# EAGLE design DigiPCJoy (EAGLE 7.2.0)
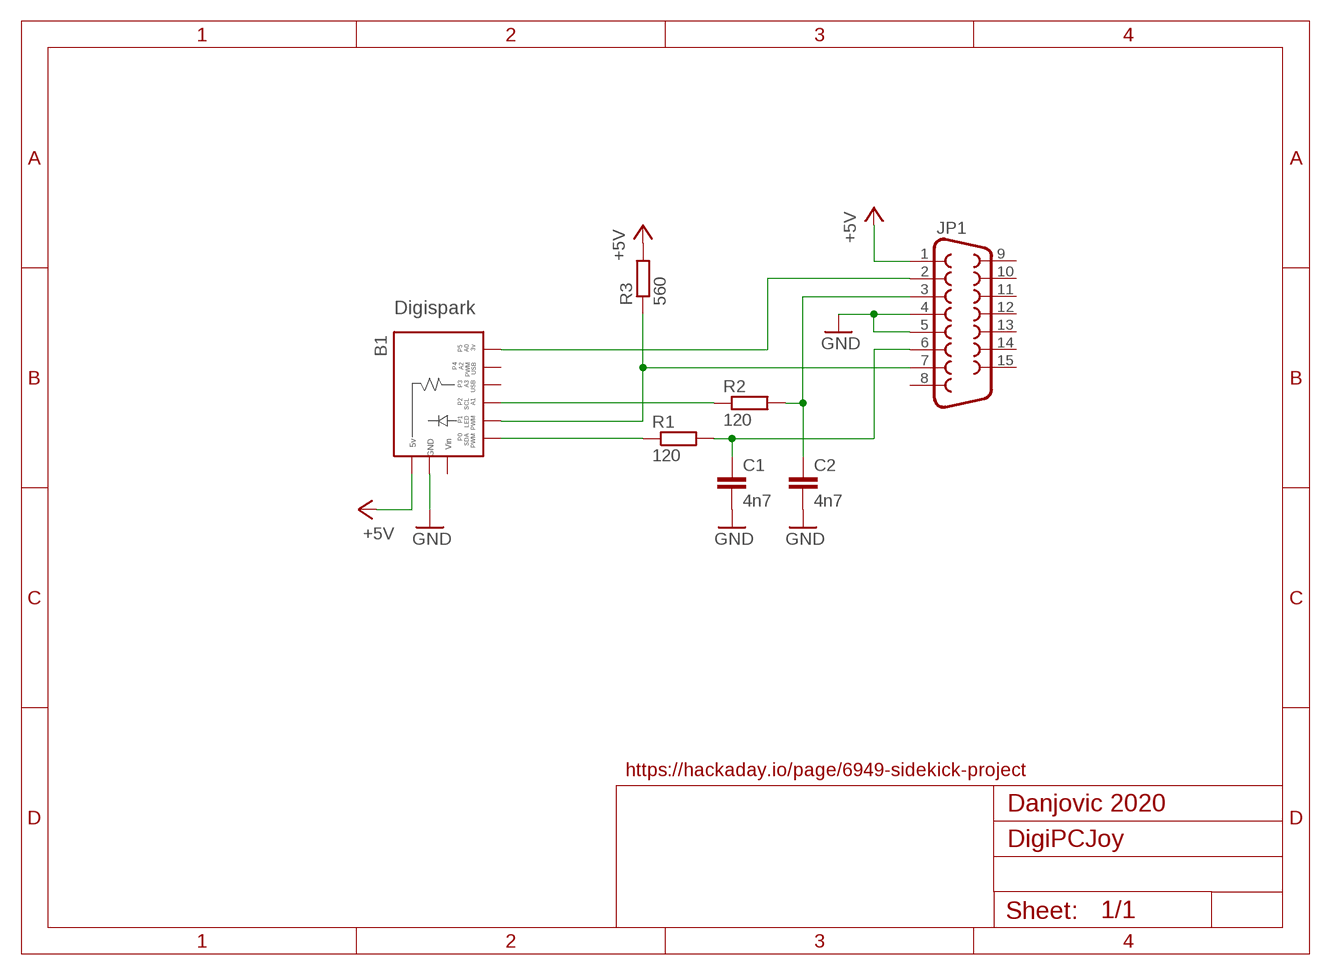
[diagram p0: schematic, sheet 1]

## Parts
B1  Digispark  DIGISPARK-SOCKET  [DIGISPARK_SOCKET]
C1  4n7  C-EU050-024X044  [C050-024X044]
C2  4n7  C-EU050-024X044  [C050-024X044]
JP1  F15H  [F15H]
R1  120  R-EU_0204/7  [0204/7]
R2  120  R-EU_0204/7  [0204/7]
R3  560  R-EU_0204/7  [0204/7]

## Nets
+5V: B1.5V JP1.1 R3.2
GND: B1.GND C1.2 C2.2 JP1.4 JP1.5
N$2: B1.P5 JP1.2
N$3: C1.1 JP1.6 R1.2
N$4: C2.1 JP1.3 R2.2
P0: B1.P0 R1.1
P1: B1.P1 JP1.7 R3.1
P2: B1.P2 R2.1
Unconnected: B1.P3 B1.P4 JP1.8 JP1.9 JP1.10 JP1.11 JP1.12 JP1.13 JP1.14 JP1.15

## Notes on the sheet
- Digispark
- https://hackaday.io/page/6949-sidekick-project
- Danjovic 2020

## Power pins joined to a net without a drawn wire
VIN: B1.VIN

## Library data of the parts
B1 = Digistump:DIGISPARK: Digispark http://digistump.com/wiki/digispark
C1 C2 = rcl:C-EU: CAPACITOR, European symbol
JP1 = con-subd:F15: SUB-D; OC_FARNELL: unknown; OC_NEWARK: unknown
R1-R3 = rcl:R-EU_: RESISTOR, European symbol

## Board
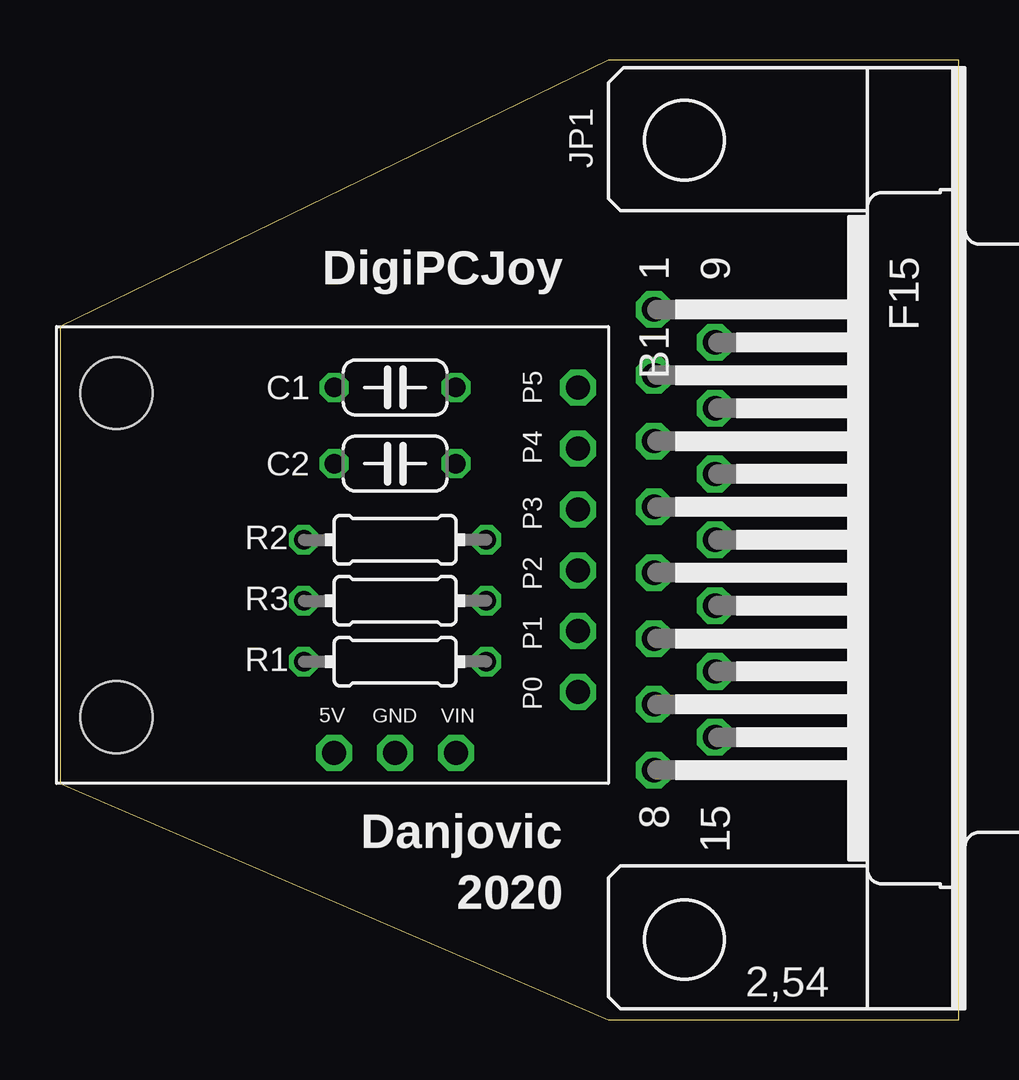
[diagram p1: board, top side]
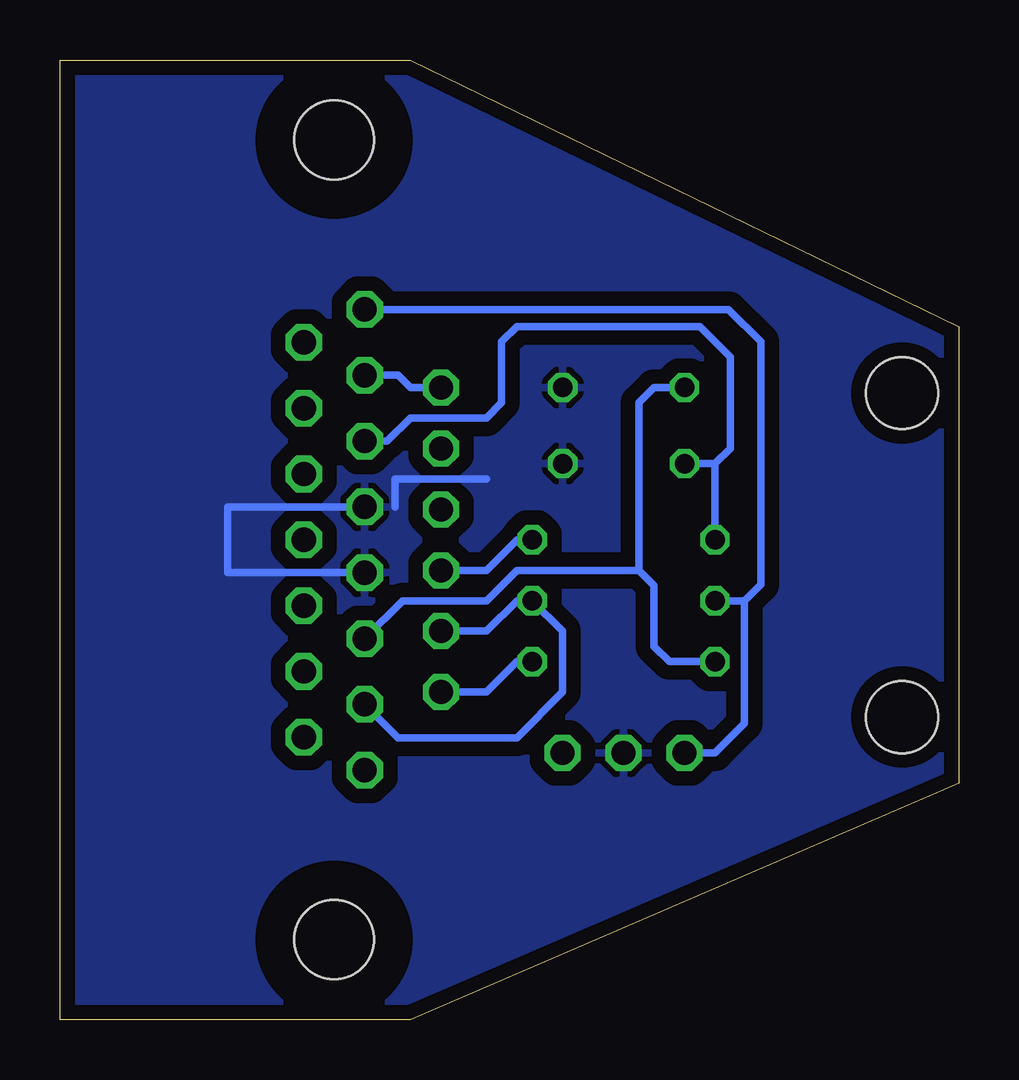
[diagram p2: board, bottom side, seen from below]

Size 37.47 x 40 mm. Coordinates in mm from the lower left corner, seen from the top.
Outline: 0,28.89 0,9.84 22.86,0 37.47,0 37.47,40 22.86,40 0,28.89
Copper layers (1*16): Top 0.0356mm / dielectric 1.5011mm / Bottom 0.0356mm
Design rules "default *": minimum track width 12mil, minimum drill 13mil, track to track 12mil, track to pad 12mil, pad to pad 12mil, via to via 12mil, smd to smd 8mil, copper to edge 15mil, drill to drill 12mil, minimum pad ring 7mil, minimum via ring 7mil, stop-mask expansion 4mil, vias tented up to drill 0mil, thermal gap 10mil

### Footprints (pad centres in the part's own frame; a part is rotated, then mirrored left to right if it is on the bottom)
DIGISPARK_SOCKET = drill 1 octagon: 5V 17.78,-11.43; GND 17.78,-8.89; P0 15.24,-1.27; P1 12.7,-1.27; P2 10.16,-1.27; P3 7.62,-1.27; P4 5.08,-1.27; P5 2.54,-1.27; VIN 17.78,-6.35 | hole 3: 2.775,-20.5; 16.275,-20.5
C050-024X044 = drill 0.813 octagon: 1 -2.54,0; 2 2.54,0
F15H = drill 1.016 octagon: 1 -9.601,-1.27; 2 -6.858,-1.27; 3 -4.115,-1.27; 4 -1.372,-1.27; 5 1.372,-1.27; 6 4.115,-1.27; 7 6.858,-1.27; 8 9.601,-1.27; 9 -8.23,1.27; 10 -5.486,1.27; 11 -2.743,1.27; 12 0,1.27; 13 2.743,1.27; 14 5.486,1.27; 15 8.23,1.27 | hole 3.302: -16.662,0; 16.662,0
0204/7 = drill 0.813 octagon: 1 -3.81,0; 2 3.81,0

### Placement (x,y rotation side)
B1  22.86,28.89 270 top
C1  13.97,26.35 0 top
C2  13.97,23.18 0 top
JP1  26.04,20 270 top
R1  13.97,14.92 180 top
R2  13.97,20 180 top
R3  13.97,17.46 180 top

### Tracks (layer width: path | path; a pad name or v marks a point on that pad's centre or on a via)
+5V
  Bottom 0.305: JP1.1 9.6,29.6 8.26,28.26 8.26,18.14 8.93,17.46 | 8.93,17.46 R3.2 | B1.5V 10.16,11.11 8.93,12.34 8.93,17.46
GND
  Bottom 0.305: 23.49,21.37 23.49,22.54 19.68,22.54 | JP1.4 30.48,21.37 30.48,18.63 JP1.5
  pour Bottom (isolate 0.61): 0,9.84 23.49,-0.32 37.47,-0.32 37.47,40.32 22.86,40.32 0,28.89
N$2
  Bottom 0.305: JP1.2 23.37,26.86 22.86,26.35 B1.P5
N$3
  Bottom 0.305: JP1.6 23.19,17.46 19.68,17.46 18.41,18.73 13.34,18.73 | R1.2 12.07,14.92 12.7,15.56 12.7,18.1 13.34,18.73 | C1.1 12.7,26.35 13.34,25.72 13.34,18.73
N$4
  Bottom 0.305: JP1.3 23.82,24.12 22.86,25.08 19.68,25.08 19.05,25.72 19.05,28.26 18.41,28.89 10.79,28.89 9.53,27.62 9.53,23.81 10.16,23.18 | 10.16,23.18 R2.2 | C2.1 10.16,23.18
P0
  Bottom 0.305: R1.1 18.41,14.92 19.68,13.65 B1.P0
P1
  Bottom 0.305: B1.P1 19.68,16.19 18.41,17.46 R3.1 16.51,16.19 16.51,13.65 18.41,11.75 23.37,11.75 JP1.7
P2
  Bottom 0.305: R2.1 18.41,20 19.68,18.73 B1.P2

### Text on the board
tPlace: DigiPCJoy | P5 | P4 | P3 | P2 | P1 | 5V | GND | VIN | P0 | Danjovic | 2020